# EAGLE design blue_plant_1.0 (EAGLE 6.1)
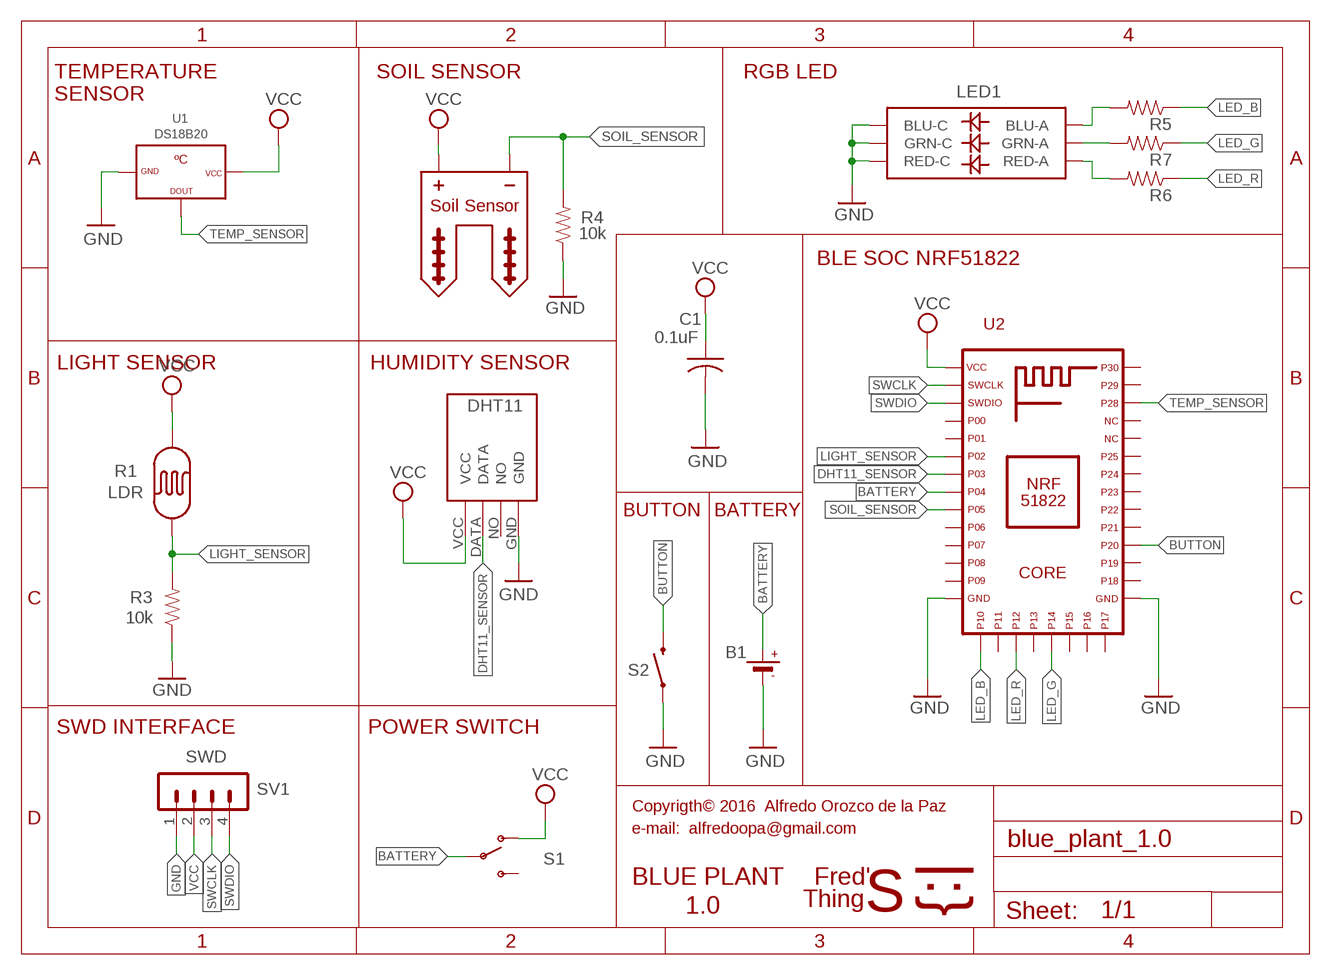
[diagram p0: schematic, sheet 1]

## Parts
B1  BATTERYCR2032  [CR2032]
C1  0.1uF  C-US025_050-025X075  [C025_050-025X075]
LED1  RGB-5050  LED-TRICOLOR-5050NO_IC  [LED-TRICOLOR-5050]
R1  LDR  PHOTOCELLPTH-KIT  [PHOTOCELL-KIT]
R2  SOIL-SENSOR  [SOIL-SENSOR-1]
R3  10k  RESISTORKIT  [AXIAL-0.3-KIT]
R4  10k  RESISTORKIT  [AXIAL-0.3-KIT]
R5  RESISTORKIT  [AXIAL-0.3-KIT]
R6  RESISTORKIT  [AXIAL-0.3-KIT]
R7  RESISTORKIT  [AXIAL-0.3-KIT]
S1  SWITCH-SPDT-SMD-A  [SWITCH-SPST-SMD-A]
S2  SWITCH-MOMENTARY-2SMD  [TACTILE_SWITCH_SMD]
SV1  SWD  MA04-1  [MA04-1]
U1  DS18B20  [TO-92]
U2  NRF51822-CORE-2  [NRF51822-CORE2]
U$1  DHT11  [DHT11]

## Nets
BATTERY: B1.+ S1.2(P) U2.P18(P04)
BUTTON: S2.3 U2.P20
DHT11_SENSOR: U2.P17(P03) U$1.DATA
GND: B1.- C1.2 LED1.4(BLU-C) LED1.5(RED-C) LED1.6(GRN-C) R3.P$1 R4.P$1 S2.1 SV1.1 U1.1(GND) U2.P1(GND1) U2.P12(GND2) U$1.GND
LED_B: R5.P$1 U2.P32(P10)
LED_G: R7.P$1 U2.P28(P14)
LED_R: R6.P$1 U2.P30(P12)
LIGHT_SENSOR: R1.1 R3.P$2 U2.P16(P02)
N$7: LED1.1(GRN-A) R7.P$2
N$8: LED1.3(BLU-A) R5.P$2
N$9: LED1.2(RED-A) R6.P$2
SOIL_SENSOR: R2.P$1(PG) R4.P$2 U2.P35(P05)
SWCLK: SV1.3 U2.P24(SWDCLK)
SWDIO: SV1.4 U2.P23(SWDIO)
TEMP_SENSOR: U1.2(DOUT) U2.P9(P28)
VCC: C1.1 R1.2 R2.P$2(PS) S1.1(O) SV1.2 U1.3(VCC) U2.P11(VCC) U$1.VCC
Unconnected: S1.3(S) U2.P2(P21) U2.P3(P22) U2.P4(P23) U2.P5(P24) U2.P6(P25) U2.P7(P26) U2.P8(P27) U2.P10(P29) U2.P13(P30) U2.P14(P00) U2.P15(P01) U2.P19(P18) U2.P21(P17) U2.P22(P19) U2.P25(P15) U2.P26(P16) U2.P27(P13) U2.P29(P11) U2.P31(P09) U2.P33(P07) U2.P34(P08) U2.P36(P06) U$1.NO

## Notes on the sheet
- TEMPERATURE | SOIL SENSOR | RGB LED
- SENSOR
- BLE SOC NRF51822
- LIGHT SENSOR | HUMIDITY SENSOR
- BUTTON | BATTERY
- SWD INTERFACE | POWER SWITCH
- Copyrigth© 2016  Alfredo Orozco de la Paz
- e-mail:  alfredoopa@gmail.com
- BLUE PLANT | Fred'
- 1.0 | Thing | S
- {:|

## Library data of the parts
B1 = microbuilder:BATTERY: CR1220 SMT - Digikey: 3001K-ND
C1 = adafruit:C-US: CAPACITOR, American symbol
LED1 = hwav-eagle-lib:LED-TRICOLOR-5050
R1 = SparkFun-Sensors:PHOTOCELL: CdS photoresistor. This is a low cost way to detect light levels. Resistance decreases with more incoming light. SparkFun SKU: SEN-09088
R2 = hwav-eagle-lib:SOIL-SENSOR: Sensor de humedad en tierra resistivo. Sensor para medir la humedad de la tierra.
R3-R7 = SparkFun-Passives:RESISTOR: Resistor Basic schematic elements and footprints for 0603, 1206, and PTH resistors.
S1 = SparkFun-Electromechanical:SWITCH-SPDT: SPDT Switch Simple slide switch, Spark Fun Electronics SKU : COM-00102 DPDT SMT slide switch, AYZ0202, SWCH-08179
S2 = SparkFun-Electromechanical:SWITCH-MOMENTARY-2: Various NO switches- pushbuttons, reed, etc
SV1 = con-lstb:MA04-1: PIN HEADER; OC_FARNELL: unknown; OC_NEWARK: unknown
U1 = hwav-eagle-lib:DS18B20: Sensor de temperatura en grados ºC DS18B20 de Maxim. Se comunica por el protocolo One Wire.
U2 = hwav-eagle-lib:NRF51822-CORE-2
U$1 = DHT11:DHT11: DHT11 Czujnik temperatury i wilgotności

## Board
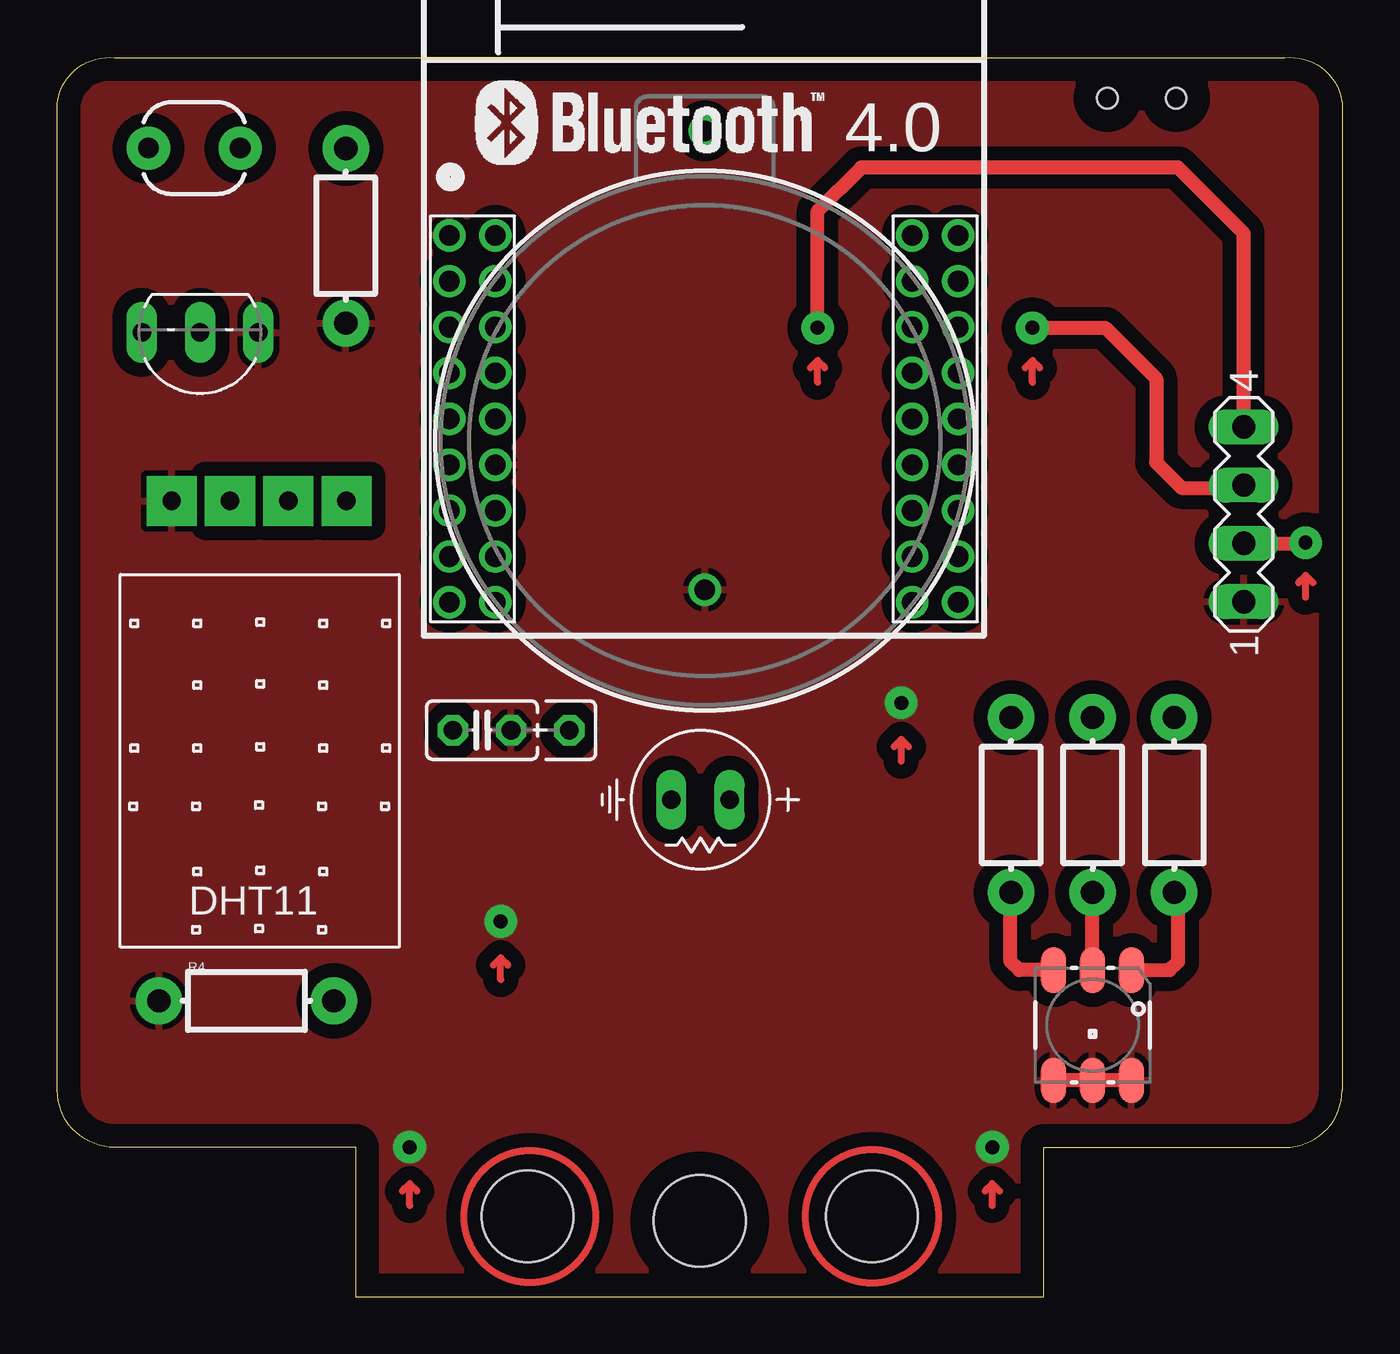
[diagram p1: board, top side]
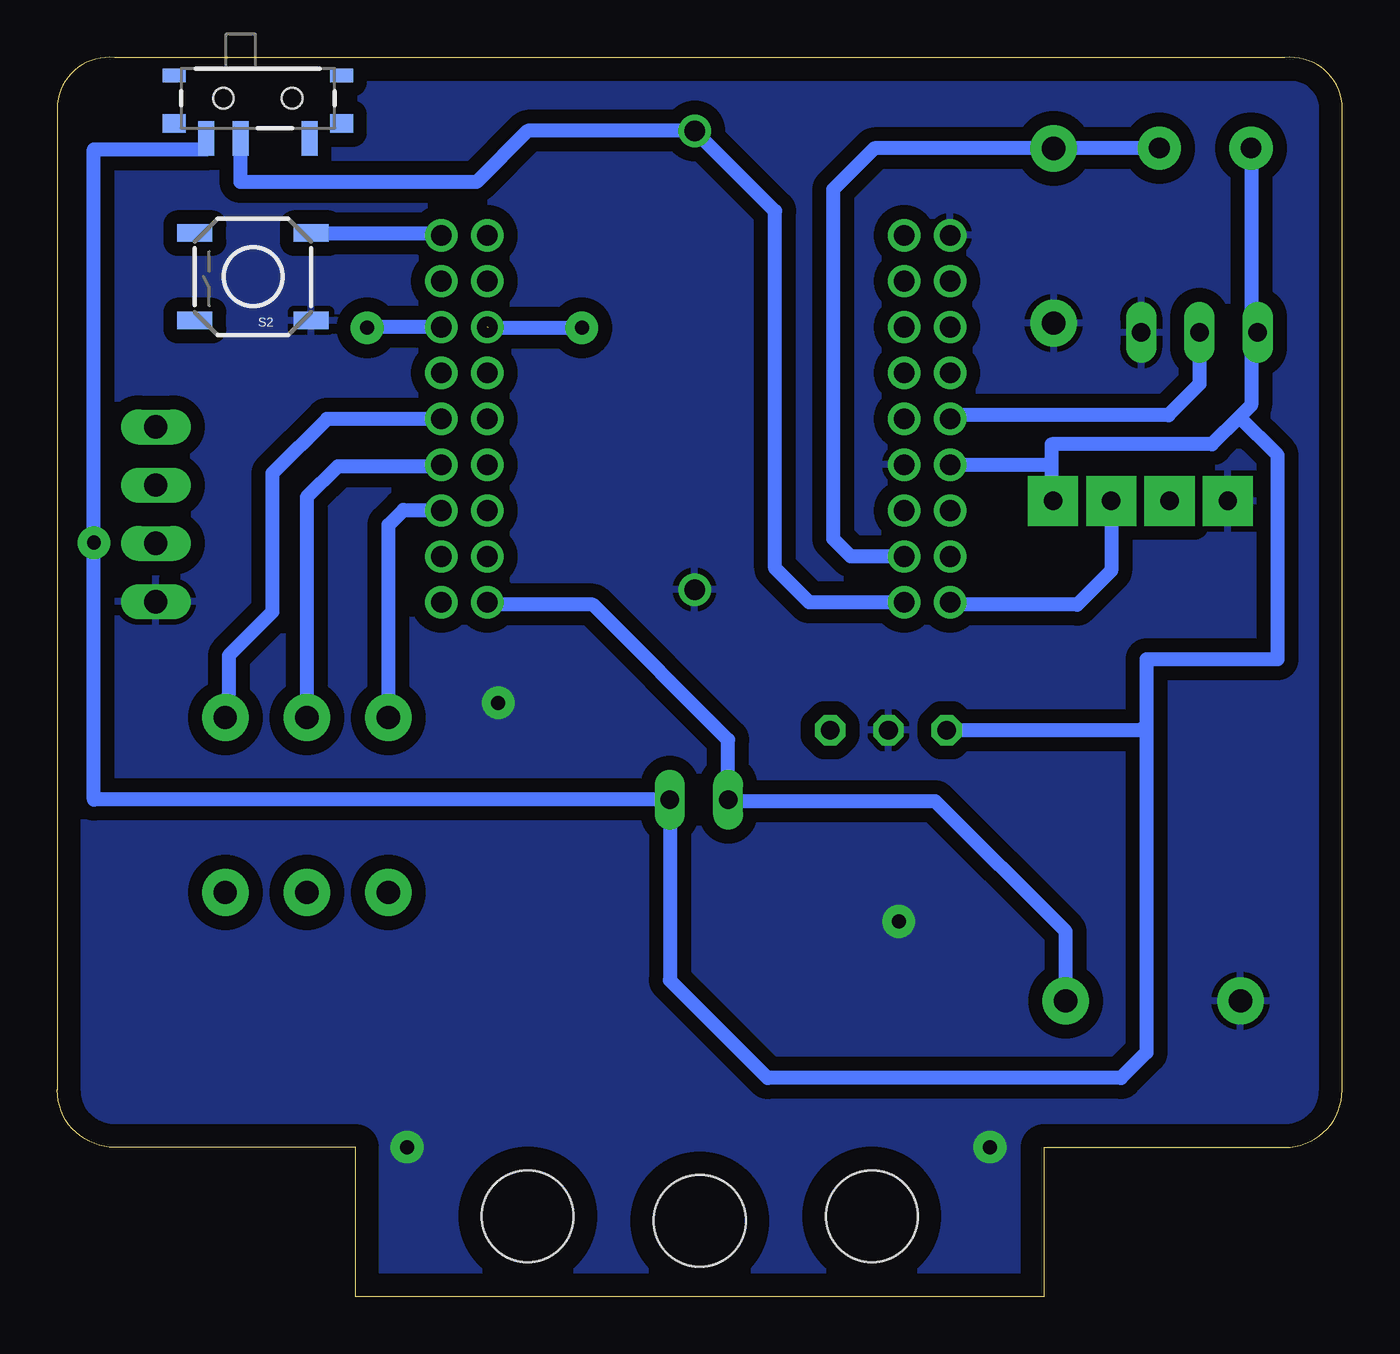
[diagram p2: board, bottom side, seen from below]

Size 56 x 54.01 mm. Coordinates in mm from the lower left corner, seen from the top.
Outline: 13,0 43,0 43,6.5 53.5,6.5 arc90 56,9 56,52 arc90 53.5,54 2.5,54 arc90 0,52 0,9 arc90 2.5,6.5 13,6.5 13,0
Copper layers (1*16): Top 0.035mm / dielectric 1.5mm / Bottom 0.035mm
Design rules: minimum track width 10mil, minimum drill 24mil, track to track 8mil, track to pad 8mil, pad to pad 8mil, via to via 8mil, smd to smd 8mil, copper to edge 40mil, drill to drill 8mil, minimum pad ring 10mil, minimum via ring 8mil, stop-mask expansion 4mil, vias tented up to drill 0mil, thermal gap 10mil
Holes 4 mm at 35.5,3.5 20.5,3.5 28,3.3

### Footprints (pad centres in the part's own frame; a part is rotated, then mirrored left to right if it is on the bottom)
CR2032 = drill 0.9: + 10,0; - -10,0
C025_050-025X075 = drill 0.813 octagon: 1 -1.27,0; 2 1.27,0; 3 3.81,0
LED-TRICOLOR-5050 = smd 2 x 1.1: 1 -2.4,1.7; 2 -2.4,0; 3 -2.4,-1.7; 4 2.4,-1.7; 5 2.4,0; 6 2.4,1.7
PHOTOCELL-KIT = drill 0.9 pad 1.88: 1 -2,0; 2 2,0
SOIL-SENSOR-1 = drill 0.8 long: P$1 -1.27,0; P$2 1.27,0
AXIAL-0.3-KIT = drill 1.016 pad 2.032: P$1 -3.81,0; P$2 3.81,0
SWITCH-SPST-SMD-A = smd 0.7 x 1.5: 1 -2.25,-1.75; 2 -0.75,-1.75; 3 2.25,-1.75 | smd 1 x 0.6: GND1 -3.65,1; GND3 3.65,1 | smd 1 x 0.8: GND2 -3.65,-1.1; GND4 3.65,-1.1 | hole 0.9: -1.5,0; 1.5,0
TACTILE_SWITCH_SMD = smd 1.524 x 0.762: 1 -2.54,1.905; 2 2.54,1.905; 3 -2.54,-1.905; 4 2.54,-1.905
MA04-1 = drill 1.016 long: 1 -3.81,0; 2 -1.27,0; 3 1.27,0; 4 3.81,0
TO-92 = drill 0.813 long: 1 -2.54,0; 2 0,0; 3 2.54,0
NRF51822-CORE2 = drill 0.9: P1 -10.938,4.816; P2 -8.938,4.816; P3 -10.938,2.816; P4 -8.938,2.816; P5 -10.938,0.816; P6 -8.938,0.816; P7 -10.938,-1.184; P8 -8.938,-1.184; P9 -10.938,-3.184; P10 -8.938,-3.184; P11 -10.938,-5.184; P12 -8.938,-5.184; P13 -10.938,-7.184; P14 -8.938,-7.184; P15 -10.938,-9.184; P16 -8.938,-9.184; P17 -10.938,-11.184; P18 -8.938,-11.184; P19 9.23,4.816; P20 11.23,4.816; P21 9.23,2.816; P22 11.23,2.816; P23 9.23,0.816; P24 11.23,0.816; P25 9.23,-1.184; P26 11.23,-1.184; P27 9.23,-3.184; P28 11.23,-3.184; P29 9.23,-5.184; P30 11.23,-5.184; P31 9.23,-7.184; P32 11.23,-7.184; P33 9.23,-9.184; P34 11.23,-9.184; P35 9.23,-11.184; P36 11.23,-11.184
DHT11 = drill 0.8 pad 2.184 square: DATA -1.27,-11.43; GND 3.81,-11.43; NO 1.27,-11.43; VCC -3.81,-11.43

### Placement (x,y rotation side)
B1  28.22,40.81 90 top
C1  18.51,24.69 0 top
LED1  45.12,11.83 270 top
R1  5.97,50.06 180 top
R2  28.03,21.66 0 top
R3  12.57,46.24 90 top
R4  8.24,12.89 0 top
R5  41.57,21.43 270 top
R6  45.13,21.43 270 top
R7  48.68,21.43 270 top
S1  47.26,52.23 0 bottom
S2  47.47,44.45 180 bottom
SV1  51.71,34.1 90 top
U1  6.22,42.02 180 top
U2  28.03,41.44 0 top
U$1  8.79,23.25 180 top

### Tracks (layer width: path | path; a pad name or v marks a point on that pad's centre or on a via)
BATTERY
  Bottom 0.61: U2.P18 23.23,30.26 24.72,31.75 24.72,47.31 B1.+ 35.51,50.81 37.74,48.58 48.01,48.58 S1.2
BUTTON
  Bottom 0.61: S2.3 39.36,46.36 U2.P20
DHT11_SENSOR
  Bottom 0.61: U$1.DATA 10.06,31.64 11.54,30.16 17,30.16 U2.P17
GND  (via drill 0.6 pad 1.42)
  Top 0.61: LED1.6 LED1.5 LED1.4
  other vias: 40.75,6.51 36.79,25.88 15.35,6.51 19.32,16.35
  pour Bottom (isolate 0.61): 13,0 13,6.5 0,6.5 0,54.51 56,54.51 56,6.5 43,6.5 43,0
  pour Top (isolate 0.61): 12.97,-0.95 12.97,6.51 -0.68,6.51 -0.68,54.13 57.9,54.13 57.9,6.35 43.13,6.35 43.13,-0.79
LED_B
  Bottom 0.61: R5.P$1 41.57,33.63 40.91,34.29 39.29,34.29 U2.P32
LED_G
  Bottom 0.61: U2.P28 44.25,38.26 46.63,35.88 46.63,29.85 48.53,27.94 48.53,26.34 R7.P$1
LED_R
  Bottom 0.61: U2.P30 39.32,36.2 43.77,36.2 45.13,34.84 R6.P$1
LIGHT_SENSOR
  Bottom 0.61: R1.1 12.56,50.06 R3.P$2 20.39,50.05 22.18,48.26 22.18,33.02 21.42,32.26 U2.P16
N$1
  Top 0.305: 33.13,39.85 33.13,40.8 | 33.13,40.8 32.82,40.48 | 33.13,40.8 33.45,40.48
N$2
  Top 0.305: 42.5,39.85 42.5,40.8 | 42.5,40.8 42.18,40.48 | 42.5,40.8 42.82,40.48
N$3
  Top 0.305: 54.41,30.48 54.41,31.43 | 54.41,31.43 54.09,31.12 | 54.41,31.43 54.72,31.12
N$7
  Top 0.61: LED1.1 48.48,14.23 48.85,14.61 48.85,17.45 R7.P$2
N$8
  Top 0.61: LED1.3 41.92,14.23 41.55,14.61 41.55,17.59 R5.P$2
N$9
  Top 0.61: LED1.2 R6.P$2
N$10
  Top 0.305: 15.35,3.97 15.35,4.92 | 15.35,4.92 15.04,4.6 | 15.35,4.92 15.67,4.6
N$11
  Top 0.305: 40.75,3.97 40.75,4.92 | 40.75,4.92 40.44,4.6 | 40.75,4.92 41.07,4.6
N$12
  Top 0.305: 36.79,23.34 36.79,24.29 | 36.79,24.29 36.47,23.97 | 36.79,24.29 37.1,23.97
N$13
  Top 0.305: 19.32,13.81 19.32,14.76 | 19.32,14.76 19,14.45 | 19.32,14.76 19.64,14.45
SOIL_SENSOR
  Bottom 0.61: R4.P$2 12.05,15.91 17.73,21.59 26.69,21.59 R2.P$1 26.76,24.27 32.66,30.16 37.17,30.16 U2.P35
SWCLK  (via drill 0.6 pad 1.42)
  Top 0.61: v42.5,42.23 45.67,42.23 47.9,40.01 47.9,36.35 49.01,35.24 51.59,35.24 SV1.3
  Bottom 0.61: U2.P24 42.47,42.26 v42.5,42.23
SWDIO  (via drill 0.6 pad 1.42)  (1 unrouted)
  Top 0.61: SV1.4 51.71,46.35 48.85,49.21 35.04,49.21 33.13,47.31 v33.13,42.23
  Bottom 0.61: 37.23,42.23 v33.13,42.23
TEMP_SENSOR
  Bottom 0.61: U1.2 6.22,39.77 7.58,38.42 16.93,38.42 U2.P9
VCC  (via drill 0.6 pad 1.42)
  Top 0.61: SV1.2 54.37,32.83 v54.41,32.86
  Bottom 0.61: R1.2 3.97,42.31 | 3.97,42.31 U1.3 | 3.97,42.31 3.97,38.85 4.48,38.34 | 4.48,38.34 5.67,37.15 12.66,37.15 12.66,36.26 | U2.P11 12.66,36.26 | U$1.VCC 12.66,34.68 12.66,36.26 | 4.48,38.34 2.81,36.67 2.81,27.78 8.53,27.78 8.53,24.92 | 8.53,24.92 8.53,10.64 9.64,9.53 25.04,9.53 29.3,13.79 R2.P$2 54.41,21.66 v54.41,32.86 54.41,50.01 49.51,50.01 S1.1 | C1.1 8.76,24.69 8.53,24.92
(copper drawn outside any net)
  shapes: Top circle x2